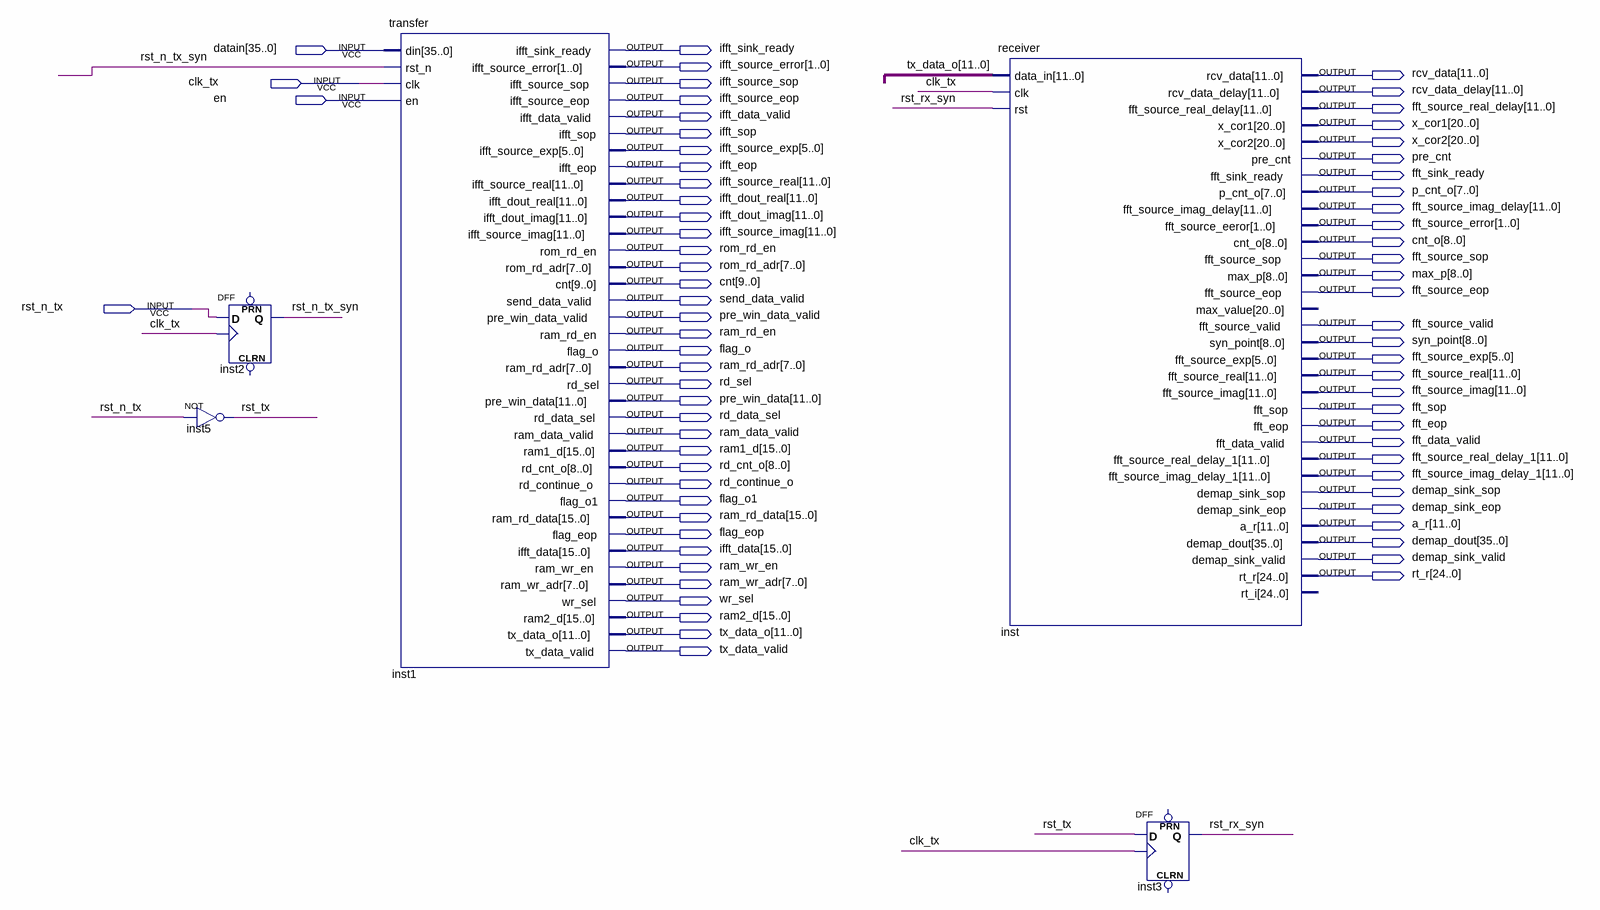
[diagram p0: schematic sheet]
// Quartus schematic plc_design.bdf as structural Verilog: 5 symbols, 71 pins
module plc_design (
  input  [35:0] datain,
  input  clk_tx,
  input  en,
  input  rst_n_tx,
  output ifft_sink_ready,
  output [1:0] ifft_source_error,
  output [11:0] rcv_data,
  output ifft_source_sop,
  output [11:0] rcv_data_delay,
  output ifft_source_eop,
  output [11:0] fft_source_real_delay,
  output ifft_data_valid,
  output [20:0] x_cor1,
  output ifft_sop,
  output [20:0] x_cor2,
  output [5:0] ifft_source_exp,
  output pre_cnt,
  output ifft_eop,
  output fft_sink_ready,
  output [11:0] ifft_source_real,
  output [7:0] p_cnt_o,
  output [11:0] ifft_dout_real,
  output [11:0] fft_source_imag_delay,
  output [11:0] ifft_dout_imag,
  output [1:0] fft_source_error,
  output [11:0] ifft_source_imag,
  output [8:0] cnt_o,
  output rom_rd_en,
  output fft_source_sop,
  output [7:0] rom_rd_adr,
  output [8:0] max_p,
  output [9:0] cnt,
  output fft_source_eop,
  output send_data_valid,
  output pre_win_data_valid,
  output fft_source_valid,
  output ram_rd_en,
  output [8:0] syn_point,
  output flag_o,
  output [5:0] fft_source_exp,
  output [7:0] ram_rd_adr,
  output [11:0] fft_source_real,
  output rd_sel,
  output [11:0] fft_source_imag,
  output [11:0] pre_win_data,
  output fft_sop,
  output rd_data_sel,
  output fft_eop,
  output ram_data_valid,
  output fft_data_valid,
  output [15:0] ram1_d,
  output [11:0] fft_source_real_delay_1,
  output [8:0] rd_cnt_o,
  output [11:0] fft_source_imag_delay_1,
  output rd_continue_o,
  output demap_sink_sop,
  output flag_o1,
  output demap_sink_eop,
  output [15:0] ram_rd_data,
  output [11:0] a_r,
  output flag_eop,
  output [35:0] demap_dout,
  output [15:0] ifft_data,
  output demap_sink_valid,
  output ram_wr_en,
  output [24:0] rt_r,
  output [7:0] ram_wr_adr,
  output wr_sel,
  output [15:0] ram2_d,
  output [11:0] tx_data_o,
  output tx_data_valid
);

  wire rst_n_tx_syn, rst_rx_syn, rst_tx;

  not inst5 (rst_tx, rst_n_tx);
  DFF inst2 (.CLK(clk_tx), .D(rst_n_tx), .Q(rst_n_tx_syn));  // open: CLRN, PRN
  transfer inst1 (
    .din(datain), .rst_n(rst_n_tx_syn), .clk(clk_tx), .en(en), .ifft_sink_ready(ifft_sink_ready),
    .ifft_source_error(ifft_source_error), .ifft_source_sop(ifft_source_sop),
    .ifft_source_eop(ifft_source_eop), .ifft_data_valid(ifft_data_valid), .ifft_sop(ifft_sop),
    .ifft_source_exp(ifft_source_exp), .ifft_eop(ifft_eop), .ifft_source_real(ifft_source_real),
    .ifft_dout_real(ifft_dout_real), .ifft_dout_imag(ifft_dout_imag), .ifft_source_imag(ifft_source_imag),
    .rom_rd_en(rom_rd_en), .rom_rd_adr(rom_rd_adr), .cnt(cnt), .send_data_valid(send_data_valid),
    .pre_win_data_valid(pre_win_data_valid), .ram_rd_en(ram_rd_en), .flag_o(flag_o), .ram_rd_adr(ram_rd_adr),
    .rd_sel(rd_sel), .pre_win_data(pre_win_data), .rd_data_sel(rd_data_sel), .ram_data_valid(ram_data_valid),
    .ram1_d(ram1_d), .rd_cnt_o(rd_cnt_o), .rd_continue_o(rd_continue_o), .flag_o1(flag_o1),
    .ram_rd_data(ram_rd_data), .flag_eop(flag_eop), .ifft_data(ifft_data), .ram_wr_en(ram_wr_en),
    .ram_wr_adr(ram_wr_adr), .wr_sel(wr_sel), .ram2_d(ram2_d), .tx_data_o(tx_data_o),
    .tx_data_valid(tx_data_valid));
  receiver inst (
    .data_in(tx_data_o), .clk(clk_tx), .rst(rst_rx_syn), .rcv_data(rcv_data),
    .rcv_data_delay(rcv_data_delay), .fft_source_real_delay(fft_source_real_delay), .x_cor1(x_cor1),
    .x_cor2(x_cor2), .pre_cnt(pre_cnt), .fft_sink_ready(fft_sink_ready), .p_cnt_o(p_cnt_o),
    .fft_source_imag_delay(fft_source_imag_delay), .fft_source_eeror(fft_source_error), .cnt_o(cnt_o),
    .fft_source_sop(fft_source_sop), .max_p(max_p), .fft_source_eop(fft_source_eop),
    .fft_source_valid(fft_source_valid), .syn_point(syn_point), .fft_source_exp(fft_source_exp),
    .fft_source_real(fft_source_real), .fft_source_imag(fft_source_imag), .fft_sop(fft_sop),
    .fft_eop(fft_eop), .fft_data_valid(fft_data_valid), .fft_source_real_delay_1(fft_source_real_delay_1),
    .fft_source_imag_delay_1(fft_source_imag_delay_1), .demap_sink_sop(demap_sink_sop),
    .demap_sink_eop(demap_sink_eop), .a_r(a_r), .demap_dout(demap_dout), .demap_sink_valid(demap_sink_valid),
    .rt_r(rt_r));  // open: max_value, rt_i
  DFF inst3 (.CLK(clk_tx), .D(rst_tx), .Q(rst_rx_syn));  // open: CLRN, PRN
endmodule
